# Altium schematic sheet EFuse_5V.SchDoc
size A4; SheetNumber: 7; SheetTotal: 13
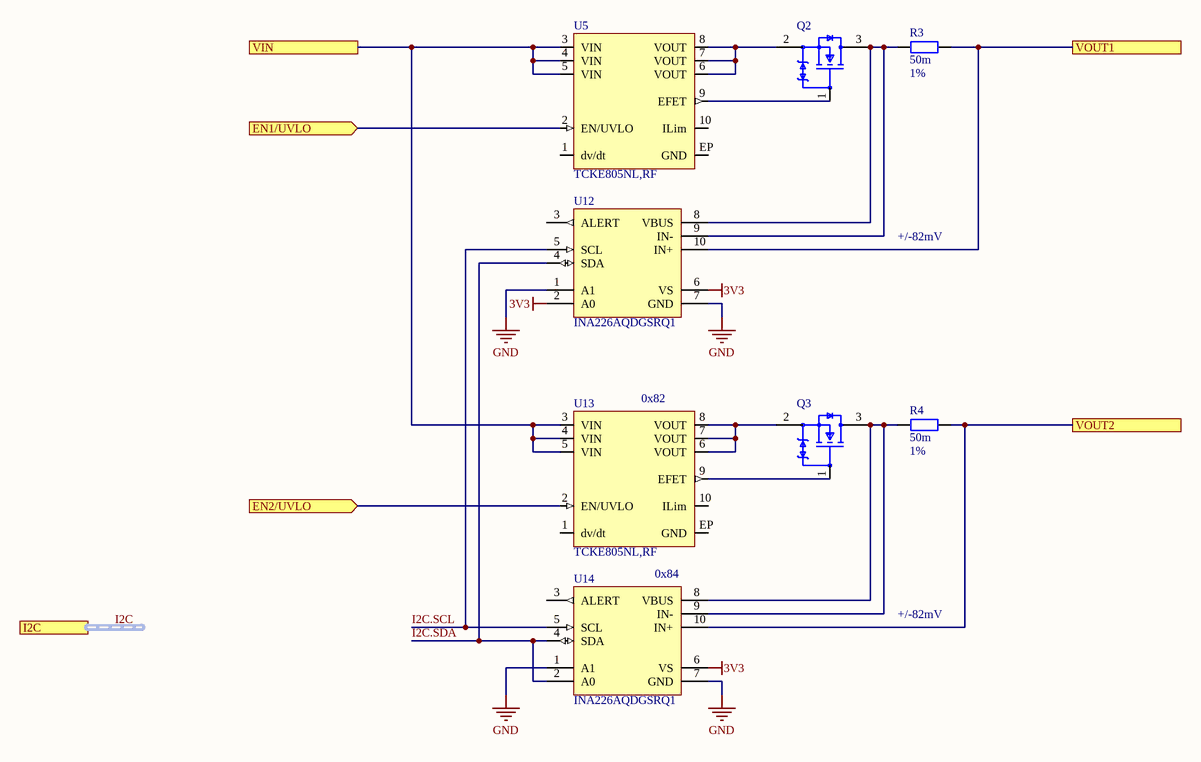
[diagram p0: EFuse_5V.SchDoc]

## Parts
Q2  DMG2302UK-7  [SOT23-3-DIODES]  (value not drawn)
Q3  DMG2302UK-7  [SOT23-3-DIODES]  (value not drawn)
R3  value 50m  Tolerance: 1%  [SMD_1206_RES]  (hidden comment: ERJ-8BWFR050V)
R4  value 50m  Tolerance: 1%  [SMD_1206_RES]  (hidden comment: ERJ-8BWFR050V)
U5  TCKE805NL,RF  [WSON10B-Toshiba]
U12  INA226AQDGSRQ1  [TI-DGS0010A-VSSOP-10]
U13  TCKE805NL,RF  [WSON10B-Toshiba]
U14  INA226AQDGSRQ1  [TI-DGS0010A-VSSOP-10]

## Ports
EN1/UVLO (in), EN2/UVLO (in), I2C (harness I2C), VIN, VOUT1, VOUT2

## Nets
3V3: U12.2(A0) U12.6(VS) U14.6(VS)
GND: U12.1(A1) U12.7(GND) U14.1(A1) U14.7(GND)
EN1/UVLO: U5.2(EN/UVLO) ; port EN1/UVLO
EN2/UVLO: U13.2(EN/UVLO) ; port EN2/UVLO
I2C.SCL: U12.5(SCL) U14.5(SCL)
I2C.SDA: U12.4(SDA) U14.2(A0) U14.4(SDA)
VIN: U5.3(VIN) U5.4(VIN) U5.5(VIN) U13.3(VIN) U13.4(VIN) U13.5(VIN) ; port VIN
VOUT1: R3.2 U12.10(IN+) ; port VOUT1
VOUT2: R4.2 U14.10(IN+) ; port VOUT2
NetQ2_1: Q2.1(G) U5.9(EFET)
NetQ2_2: Q2.2(S) U5.6(VOUT) U5.7(VOUT) U5.8(VOUT)
NetQ2_3: Q2.3(D) R3.1 U12.8(VBUS) U12.9(IN-)
NetQ3_1: Q3.1(G) U13.9(EFET)
NetQ3_2: Q3.2(S) U13.6(VOUT) U13.7(VOUT) U13.8(VOUT)
NetQ3_3: Q3.3(D) R4.1 U14.8(VBUS) U14.9(IN-)

Not connected (* = marked no-connect by the designer): U5 1(dv/dt) 10(ILim) EP(GND); U12 3(ALERT); U13 1(dv/dt) 10(ILim) EP(GND); U14 3(ALERT)

## Buses and harness runs
harness I2C = port I2C

## Notes on the sheet
- +/-82mV
- (near U13) 0x82
- 0x84

## Library data of the parts
Q2 Q3 = CMP-013-00040-A01: Transistor: N-MOSFET; unipolar; 20V; 2.2A; 0, 09ohm; 0.66W; -55+150 st.C; SMD; SOT23; Drain current: 2.8A; Nominal Vgs: 4.5V; Transistor Type: NFET; Vgs (Max): 12V; Case/Package: TO-236-3; Mounting Technology: Surface Mount; RoHS Compliant: Yes; Pins: 3; Operating Temperature (Max): 150°C; Operating Temperature (Min): -55°C; Vds (Max): 20V
R3 R4 = CMP-009-10467-A07: RES SMD 0.05 OHM 1% 1 1206 ±100ppm/°C; Power: 1W; Voltage Rating: 200V; Operating Temperature (Max): 125°C; Case/Package: 1206; Temperature Coefficient: ±100ppm/°C; RoHS Compliant: Yes; Operating Temperature (Min): -55°C; Pins: 2; Mounting Technology: SMT
U5 U13 = CMP-00024-00021-A01: Hot-Swap Ctrl, Wson-10, -40 To 85Deg C Rohs Compliant: Yes; Supply Voltage (Min): 4.4V; Supply Voltage (Max): 18V; Source Current (Max): 5A; Case/Package: WSON10; Mounting Technology: SMT; Operating Temperature (Min): -55°C; Pins: 10; Operating Temperature (Max): 150°C; RoHS Compliant: Yes
U12 U14 = CMP-015-00037-A01: SP Amp Current Shunt and Power Monitor Dual 5.5V 10-Pin VSSOP T/R; Interface: I2C; Samples Frequency: 500kHz; Sample Resolution: 16; Supply Voltage (Min): 2.7V; Signal Type: Differential; Operating Temperature (Min): -40°C; Case/Package: VSSOP; Pins: 10; Supply Voltage (Max): 5.5V; Operating Temperature (Max): 125°C; RoHS Compliant: Yes; Mounting Technology: Surface Mount